# Altium schematic sheet ADC_1W.SchDoc
size A4
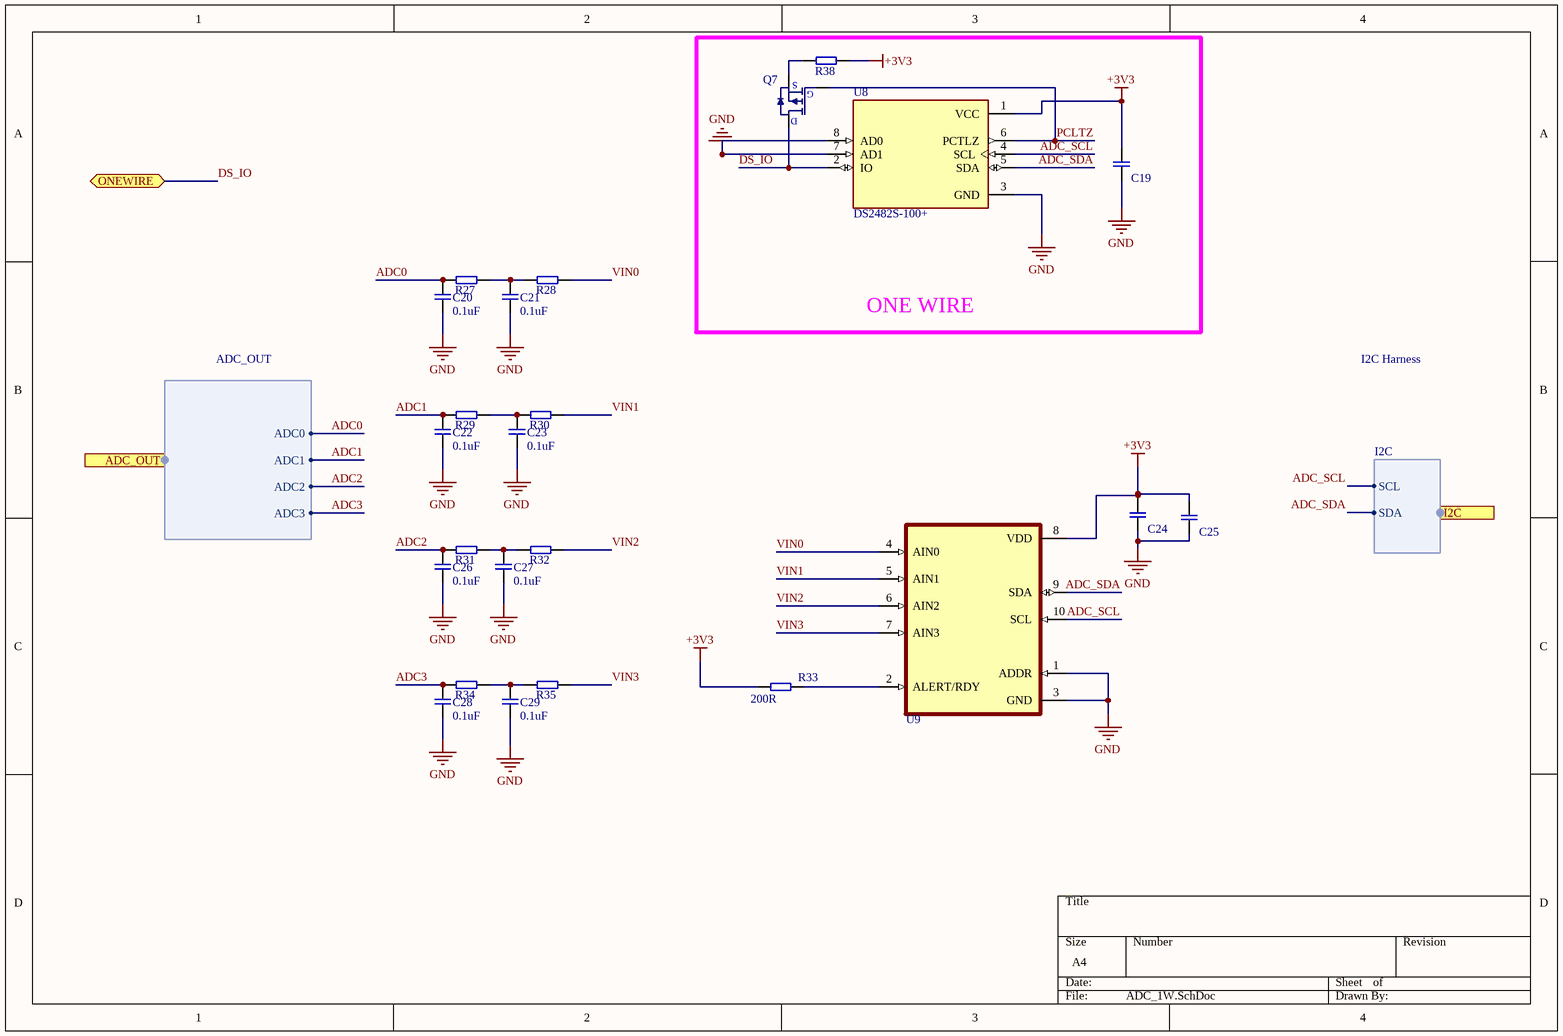
[diagram p0: ADC_1W.SchDoc]

## Parts
C19  1uF  [C0603]  (value not drawn)
C20  0.1uF  [C0402]
C21  0.1uF  [C0402]
C22  0.1uF  [C0402]
C23  0.1uF  [C0402]
C24  1uF  [C0603]  (value not drawn)
C25  10uF  [C0603]  (value not drawn)
C26  0.1uF  [C0402]
C27  0.1uF  [C0402]
C28  0.1uF  [C0402]
C29  0.1uF  [C0402]
Q7  AO3415A  [SOT-23]  (value not drawn)
R27  200R  [R0402]  (value not drawn)
R28  200R  [R0402]  (value not drawn)
R29  200R  [R0402]  (value not drawn)
R30  200R  [R0402]  (value not drawn)
R31  200R  [R0402]  (value not drawn)
R32  200R  [R0402]  (value not drawn)
R33  200R  [R0402]
R34  200R  [R0402]  (value not drawn)
R35  200R  [R0402]  (value not drawn)
R38  1K  [R0402]  (value not drawn)
U8  DS2482S-100+  [SOIC127P600X175-8N]
U9  ADS1115IDGST  [ADS1115IDGST]  (value not drawn)

## Blocks framed on the sheet
ONE WIRE: C19 Q7 R38 U8

## Ports
ADC_OUT (harness ADC_OUT), I2C (harness I2C), ONEWIRE (bidir)

## Harnesses
I2C: SCL, SDA
ADC_OUT: ADC3, ADC2, ADC1, ADC0

## Nets
+3V3: C19.2 C24.2 C25.2 R33.1 R38.1 U8.1(VCC) U9.8(VDD)
GND: C19.1 C20.1 C21.1 C22.1 C23.1 C24.1 C25.1 C26.1 C27.1 C28.1 C29.1 U8.3(GND) U8.7(AD1) U8.8(AD0) U9.1(ADDR) U9.3(GND)
ADC0: C20.2 R27.2 ; port ADC_OUT.ADC0
ADC1: C22.2 R29.2 ; port ADC_OUT.ADC1
ADC2: C26.2 R31.2 ; port ADC_OUT.ADC2
ADC3: C28.2 R34.2 ; port ADC_OUT.ADC3
ADC_SCL: U8.4(SCL) U9.10(SCL) ; port I2C.SCL
ADC_SDA: U8.5(SDA) U9.9(SDA) ; port I2C.SDA
DS_IO: Q7.3(D) U8.2(IO) ; port ONEWIRE
PCLTZ: Q7.1(G) U8.6(PCTLZ)
VIN0: R28.1 U9.4(AIN0)
VIN1: R30.1 U9.5(AIN1)
VIN2: R32.1 U9.6(AIN2)
VIN3: R35.1 U9.7(AIN3)
NetC21_2: C21.2 R27.1 R28.2
NetC23_2: C23.2 R29.1 R30.2
NetC27_2: C27.2 R31.1 R32.2
NetC29_2: C29.2 R34.1 R35.2
NetQ7_2: Q7.2(S) R38.2
NetR33_2: R33.2 U9.2(ALERT/RDY)

## Notes on the sheet
- I2C Harness

## Library data of the parts
C19 C24 = GMC10X5R105K16NT: CAP CER 1UF 16V X5R 0603; Manufacturer: CAL-CHIP ELECTRONICS, INC.; Que: 020; Tolerance: ±10%; Type: Ceramic; Name: Recep Aydin; Part Number: GMC10X5R105K16NT; Voltage: 16V; Temperature Coefficient: X5R; Package: 0603(1608 Metric); Datasheet: http://www.calchipelectronics.com/pdf/gmc_series.pdf; Manufacturer Part Number: GMC10X5R105K16NT
C20-C23 C26-C29 = C1005X5R1A104K050BA: CAP CER 0.1UF 10V X5R 0402; Manufacturer: TDK Corporation; Que: 003; Tolerance: ±10%; Type: Ceramic; Name: Recep Aydin; Part Number: C1005X5R1A104K050BA; Voltage: 10V; Temperature Coefficient: X5R; Package: 0402(1005 Metric); Datasheet: https://product.tdk.com/en/system/files?file=dam/doc/product/capacitor/ceramic/mlcc/catalog/mlcc_commercial_general_en.pdf; Manufacturer Part Number: C1005X5R1A104K050BA
C25 = GRT188R61C106KE13D: CAP CER 10UF 16V X5R 0603; Manufacturer: Murata Electronics; Que: 073; Tolerance: ±10%; Type: Ceramic; Name: Recep Aydin; Part Number: GRT188R61C106KE13D; Voltage: 16V; Temperature Coefficient: X5R; Package: 0603(1608 Metric); Datasheet: https://search.murata.co.jp/Ceramy/image/img/A01X/G101/ENG/GRT188R61C106KE13-01.pdf; Manufacturer Part Number: GRT188R61C106KE13D
Q7 = AO3415A: MOSFET P-CH 20V 5A SOT23-3L; Manufacturer: Alpha & Omega Semiconductor Inc.; Que: 002; Voltage: 1.5V,4.5V; FET Type: P-Channel; Name: Recep Aydin; Part Number: AO3415A; Technology: MOSFET; Current: 5A; Package: SOT-23-3; Datasheet: https://media.digikey.com/pdf/Data%20Sheets/Alpha%20&%20Omega/AO3415A.pdf; Manufacturer Part Number: AO3415A
R27-R35 = 0402WGF2000TCE: RES.(1005) 0402 200 Ohms 1% 1/16W 100PPM; Que: 165; Part Number: 0402WGF2000TCE
R38 = RT0402BRE071KL: RES SMD 1K OHM 0.1% 1/16W 0402; Manufacturer: Yageo; Que: 015; Name: Recep Aydin; Part Number: RT0402BRE071KL; Tolerance: 0.1%; Resistor Type: Thick Film; Package: 0402; Datasheet: https://www.yageo.com/upload/media/product/productsearch/datasheet/rchip/PYu-RT_1-to-0.01_RoHS_L_12.pdf; Manufacturer Part Number: RT0402BRE071KL
U8 = DS2482S-100+: IC BRIDGE I2C TO 1-WIRE 8-SOIC; MF: Maxim Integrated; Que: 080; Value: *; Availability: Unavailable; Package: SOIC-8 Maxim; SnapEDA_Link: https://www.snapeda.com/parts/DS2482S-100+/Maxim%20Integrated/view-part/587620/?ref=snap; Price: None; MP: DS2482S-100+; Part Number: DS2482S-100+
U9 = ADS1115IDGST: IC ADC 16BIT SIGMA-DELTA 10VSSOP; Manufacturer: Texas Instruments; Que: 047; Name: İbrahim Akbulut; Package: 10VSSOP; Availability: Unavailable; Value: *; MP: ADS1115IDGST; Price: None; Part Number: ADS1115IDGST; Function: ADC; Datasheet: https://www.digikey.com/en/products/detail/texas-instruments/ADS1115IDGST/2123284; Manufacturer Part Number: ADS1115IDGST